# Altium schematic sheet current_sense.SchDoc
size A3
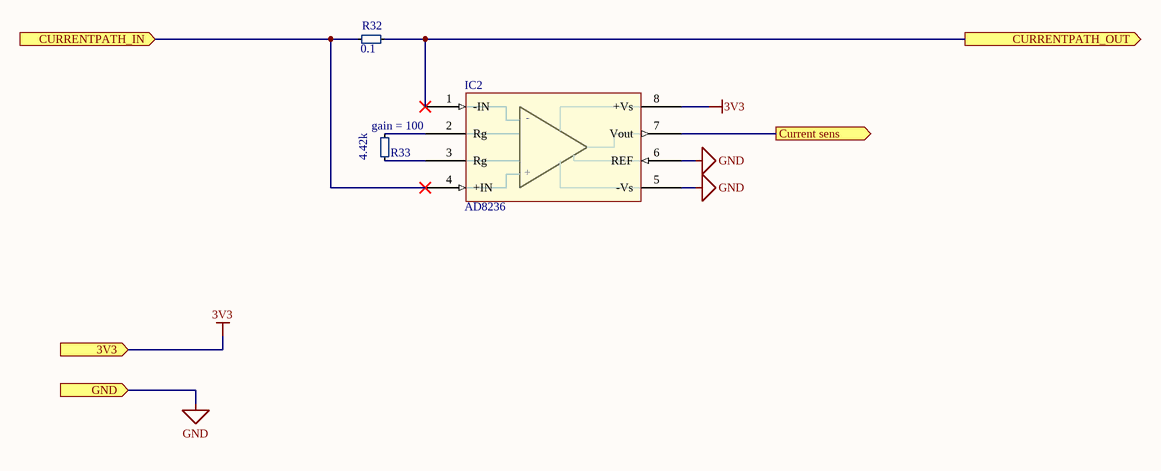
[diagram p0: current_sense.SchDoc]

## Parts
IC2  AD8236  [8-MSOP]
R32  Resistance: 0.1  [Chip2PinSM127P600-8N]  (hidden comment: ERJ-8BSFR10V)
R33  Resistance: 4.42k  [SMD_0402(1005)_M]  (hidden comment: RC0402FR-074K42L)

## Ports
3V3 (in), Current sens (out), CURRENTPATH_IN (in), CURRENTPATH_OUT (out), GND (in)

## Nets
3V3: IC2.8(+Vs) ; port 3V3
GND: IC2.5(-Vs) IC2.6(REF) ; port GND
Current sens: IC2.7(Vout) ; port Current sens
CURRENTPATH_IN: IC2.4(+IN) R32.1 ; port CURRENTPATH_IN
CURRENTPATH_OUT: IC2.1(-IN) R32.2 ; port CURRENTPATH_OUT
NetIC2_2: IC2.2(Rg) R33.2
NetIC2_3: IC2.3(Rg) R33.1

## Notes on the sheet
- (near R33) gain = 100
- (in symbol CMP-006-0000-5) -; +

## Library data of the parts
IC2 = CMP-006-0000-5: IC OPAMP INSTR 23KHZ RRO 8MSOP; Number of Channels: 1; Slew Rate: 0.011V/µs; Input Offset Voltage (Vos): 3.5mV; Common Mode Rejection Ratio: 110dB; Input Resistance: 440GR; Voltage Gain: 46.02dB; Min Supply Voltage: 1.8V; Input Bias Current: 10pA; Power Supply Rejection Ratio (PSRR): 130dB; Operating Supply Current: 40uA; Max Supply Voltage: 5.5V; Output Current per Channel: 6mA; Pin Count: 8; Design Item ID: AD8236; Source: opamp.SchLib; Package Quantity: 1; Packaging: Tape and Reel; Contact Plating: Gold; Radiation Hardening: No; Number of Elements: 1; Min Operating Temperature: -40°C; Max Operating Temperature: 125°C; Case/Package: MSOP; Lead Free: Contains Lead; Number of Circuits: 1; -3db Bandwidth: 23kHz; Mount: Surface Mount; Number of Pins: 8
R32 = CMP-0001-00003-2: Precision resistor, SMD 0.1 Ohm 0.33 W  ±  1 % 1206, ERJ8BSFR10V, Panasonic Automotive & Industrial Systems; Temperature Coefficient: 250ppm/°C; Value: 0.1; Tolerance: 1%; Power Rating: 330mW; Max Power Dissipation: 500mW; Case Code (Imperial): 1206; Min Operating Temperature: -55°C; Max Operating Temperature: 125°C; Case Code (Metric): 3216; Termination: SMD/SMT; Military Standard: Not; REACH SVHC: No SVHC; Features: Automotive AEC-Q200; Package Quantity: 5000; Length: 3.2mm; Depth: 1.6mm; Mount: Surface Mount; Case/Package: 1206; Contact Plating: Tin; Number of Terminations: 2; Radiation Hardening: No; Packaging: Tape and Reel; Composition: Thick Film,Low-Ohm-Resistor; RoHS: Yes; Width: 0.063inch; Height: 0.6mm; Number of Pins: 2
R33 = CMP-0001-00002-5: RES SMD 4.42K OHM 1% 1/16W 0402; Power Rating: 62.5mW; Max Power Dissipation: 63mW; Temperature Coefficient: 100ppm/°C; Voltage Rating: 50V; Case Code (Imperial): 0402; Length: 1mm; Min Operating Temperature: -55°C; Tolerance: 1%; Number of Terminations: 2; RoHS: Yes; Features: Moisture Resistant; Height: 0.016inch; Mount: SMD; Composition: Thick Film; Lead Free: Lead Free; Max Operating Temperature: 155°C; Termination: SMD/SMT; Military Standard: Not; Case Code (Metric): 1005; Case/Package: 0402; Contact Plating: Tin,Matte; Depth: 0.5mm; Width: 0.02inch; Packaging: Tape and Reel; Value: 4.42k